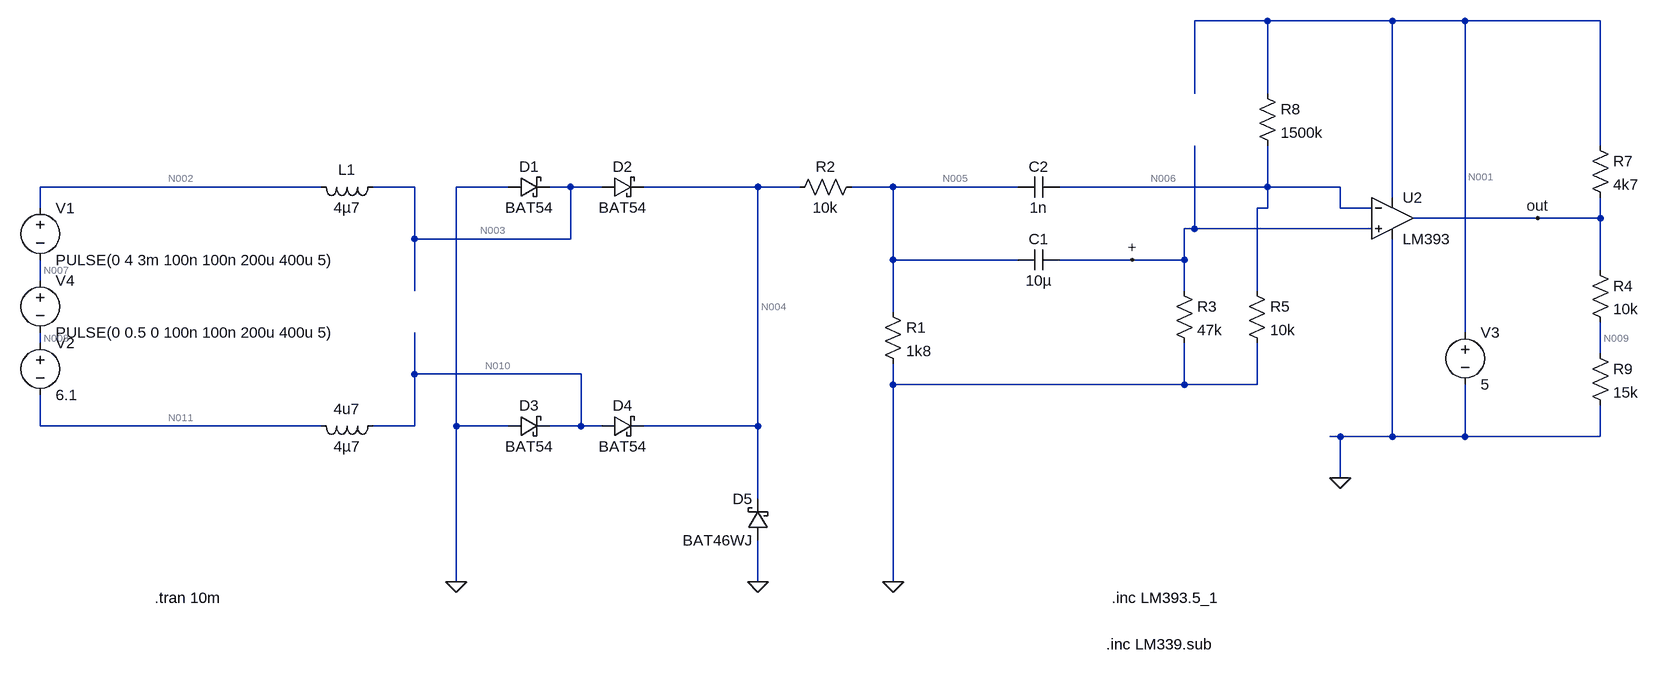
[diagram p0: schematic iRT_3.asc]
iRT_3.asc, the LTspice schematic file:
Version 4
SHEET 1 2576 804
WIRE 1584 -240 1472 -240
WIRE 1776 -240 1584 -240
WIRE 1888 -240 1776 -240
WIRE 2096 -240 1888 -240
WIRE 1472 -128 1472 -240
WIRE 1584 -128 1584 -240
WIRE 2096 -48 2096 -240
WIRE 128 16 -304 16
WIRE 272 16 208 16
WIRE 416 16 336 16
WIRE 512 16 480 16
WIRE 560 16 512 16
WIRE 800 16 624 16
WIRE 864 16 800 16
WIRE 1008 16 944 16
WIRE 1200 16 1008 16
WIRE 1584 16 1584 -48
WIRE 1584 16 1264 16
WIRE 1696 16 1584 16
WIRE 1776 32 1776 -240
WIRE -304 48 -304 16
WIRE 1584 48 1584 16
WIRE 1584 48 1568 48
WIRE 1696 48 1696 16
WIRE 1744 48 1696 48
WIRE 2000 64 1808 64
WIRE 2096 64 2096 32
WIRE 2096 64 2000 64
WIRE 1472 80 1472 -48
WIRE 1472 80 1456 80
WIRE 1744 80 1472 80
WIRE 272 96 272 16
WIRE 512 96 512 16
WIRE 512 96 272 96
WIRE 1008 128 1008 16
WIRE 1200 128 1008 128
WIRE 1376 128 1264 128
WIRE 1456 128 1456 80
WIRE 1456 128 1376 128
WIRE 2096 144 2096 64
WIRE -304 160 -304 128
WIRE 272 176 272 96
WIRE 1456 176 1456 128
WIRE 1568 176 1568 48
WIRE 1008 208 1008 128
WIRE 1888 240 1888 -240
WIRE -304 256 -304 240
WIRE 2096 272 2096 224
WIRE 272 304 272 240
WIRE 528 304 272 304
WIRE 1008 320 1008 288
WIRE 1456 320 1456 256
WIRE 1456 320 1008 320
WIRE 1568 320 1568 256
WIRE 1568 320 1456 320
WIRE -304 384 -304 336
WIRE 128 384 -304 384
WIRE 272 384 272 304
WIRE 272 384 208 384
WIRE 336 384 336 16
WIRE 416 384 336 384
WIRE 528 384 528 304
WIRE 528 384 480 384
WIRE 560 384 528 384
WIRE 800 384 800 16
WIRE 800 384 624 384
WIRE 1696 400 1680 400
WIRE 1776 400 1776 96
WIRE 1776 400 1696 400
WIRE 1888 400 1888 320
WIRE 1888 400 1776 400
WIRE 2096 400 2096 352
WIRE 2096 400 1888 400
WIRE 1696 464 1696 400
WIRE 800 496 800 384
WIRE 336 624 336 384
WIRE 800 624 800 560
WIRE 1008 624 1008 320
FLAG 800 624 0
FLAG 1008 624 0
FLAG 1696 464 0
FLAG 336 624 0
FLAG 1376 128 +
FLAG 2000 64 out
SYMBOL voltage -304 32 R0
WINDOW 123 0 0 Left 0
WINDOW 39 0 0 Left 0
SYMATTR InstName V1
SYMATTR Value PULSE(0 4 3m 100n 100n 200u 400u 5)
SYMBOL voltage -304 240 R0
WINDOW 123 0 0 Left 0
WINDOW 39 0 0 Left 0
SYMATTR InstName V2
SYMATTR Value 6.1
SYMBOL ind 224 0 R90
WINDOW 0 5 56 VBottom 2
WINDOW 3 32 56 VTop 2
SYMATTR InstName L1
SYMATTR Value 4µ7
SYMBOL ind 224 368 R90
WINDOW 0 5 56 VBottom 2
WINDOW 3 32 56 VTop 2
SYMATTR InstName 4u7
SYMATTR Value 4µ7
SYMBOL schottky 416 32 R270
WINDOW 0 32 32 VTop 2
WINDOW 3 0 32 VBottom 2
SYMATTR InstName D1
SYMATTR Value BAT54
SYMATTR Description Diode
SYMATTR Type diode
SYMBOL schottky 560 32 R270
WINDOW 0 32 32 VTop 2
WINDOW 3 0 32 VBottom 2
SYMATTR InstName D2
SYMATTR Value BAT54
SYMATTR Description Diode
SYMATTR Type diode
SYMBOL schottky 416 400 R270
WINDOW 0 32 32 VTop 2
WINDOW 3 0 32 VBottom 2
SYMATTR InstName D3
SYMATTR Value BAT54
SYMATTR Description Diode
SYMATTR Type diode
SYMBOL schottky 560 400 R270
WINDOW 0 32 32 VTop 2
WINDOW 3 0 32 VBottom 2
SYMATTR InstName D4
SYMATTR Value BAT54
SYMATTR Description Diode
SYMATTR Type diode
SYMBOL schottky 816 560 R180
WINDOW 0 24 64 Left 2
WINDOW 3 24 0 Left 2
SYMATTR InstName D5
SYMATTR Value BAT46WJ
SYMATTR Description Diode
SYMATTR Type diode
SYMBOL res 992 192 R0
SYMATTR InstName R1
SYMATTR Value 1k8
SYMBOL res 960 0 R90
WINDOW 0 0 56 VBottom 2
WINDOW 3 32 56 VTop 2
SYMATTR InstName R2
SYMATTR Value 10k
SYMBOL voltage 1888 224 R0
WINDOW 123 0 0 Left 0
WINDOW 39 0 0 Left 0
SYMATTR InstName V3
SYMATTR Value 5
SYMBOL voltage -304 144 R0
WINDOW 123 0 0 Left 0
WINDOW 39 0 0 Left 0
SYMATTR InstName V4
SYMATTR Value PULSE(0 0.5 0 100n 100n 200u 400u 5)
SYMBOL res 1440 160 R0
SYMATTR InstName R3
SYMATTR Value 47k
SYMBOL OpAmps\\opamp2 1776 0 R0
SYMATTR InstName U2
SYMATTR Value LM393
SYMBOL res 2080 -64 R0
SYMATTR InstName R7
SYMATTR Value 4k7
SYMBOL cap 1264 112 R90
WINDOW 0 0 32 VBottom 2
WINDOW 3 32 32 VTop 2
SYMATTR InstName C1
SYMATTR Value 10µ
SYMBOL cap 1264 0 R90
WINDOW 0 0 32 VBottom 2
WINDOW 3 32 32 VTop 2
SYMATTR InstName C2
SYMATTR Value 1n
SYMBOL res 1568 -144 R0
SYMATTR InstName R8
SYMATTR Value 1500k
SYMBOL res 2080 128 R0
SYMATTR InstName R4
SYMATTR Value 10k
SYMBOL res 2080 256 R0
SYMATTR InstName R9
SYMATTR Value 15k
SYMBOL res 1552 160 R0
SYMATTR InstName R5
SYMATTR Value 10k
TEXT -128 648 Left 2 !.tran 10m
TEXT 1344 648 Left 2 !.inc LM393.5_1
TEXT 1336 720 Left 2 !.inc LM339.sub

The netlist it stands for:
* iRT_3.asc
V1 N002 N007 PULSE(0 4 3m 100n 100n 200u 400u 5)
V2 N008 N011 6.1
L1 N003 N002 4µ7
L§4u7 N010 N011 4µ7
D1 0 N003 BAT54
D2 N003 N004 BAT54
D3 0 N010 BAT54
D4 N010 N004 BAT54
D5 0 N004 BAT46WJ
R1 N005 0 1k8
R2 N005 N004 10k
V3 N001 0 5
V4 N007 N008 PULSE(0 0.5 0 100n 100n 200u 400u 5)
R3 + 0 47k
XU2 + N006 N001 0 out LM393  ; pins In+ In- V+ V- OUT
R7 N001 out 4k7
C1 + N005 10µ
C2 N006 N005 1n
R8 N001 N006 1500k
R4 out N009 10k
R9 N009 0 15k
R5 N006 0 10k
.model D D
.lib standard.dio
.tran 10m
.inc LM393.5_1
.inc LM339.sub
.backanno
.end

* Results of the author's LTspice run, read from the files saved beside the schematic
* Operating Point, zero values left out:
*   V(n002) = 5.88 V
*   V(n007) = 5.88 V
*   V(n008) = 5.88 V
*   V(n011) = -220.3 mV
*   V(n003) = 5.88 V
*   V(n010) = -220.3 mV
*   V(n004) = 5.659 V
*   V(n005) = 863.3 mV
*   V(n001) = 5 V
*   V(+) = 1.811 mV
*   V(n006) = 33.23 mV
*   V(out) = 79.07 mV
*   V(n009) = 47.44 mV
*   I(D5) = -170.3 nA
*   I(D4) = -100 nA
*   I(D3) = 479.9 µA
*   I(D2) = 479.9 µA
*   I(D1) = -100 nA
*   I(4u7) = 480 µA
*   I(L1) = -480 µA
*   I(R5) = 3.323 µA
*   I(R9) = 3.163 µA
*   I(R4) = 3.163 µA
*   I(R8) = 3.311 µA
*   I(R7) = 1.047 mA
*   I(R3) = 38.54 nA
*   I(R2) = -479.6 µA
*   I(R1) = 479.6 µA
*   I(V4) = -480 µA
*   I(V3) = -1.204 mA
*   I(V2) = -480 µA
*   I(V1) = -480 µA
*   Ix(u2:1) = -38.54 nA
*   Ix(u2:2) = -11.44 nA
*   Ix(u2:3) = 153.8 µA
*   Ix(u2:4) = -1.198 mA
*   Ix(u2:5) = 1.044 mA
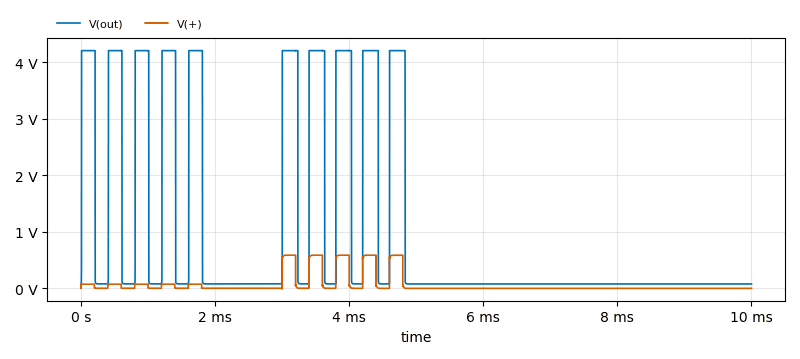
[diagram p1: Transient Analysis of iRT_3.asc, plotted from the saved traces]
* Transient Analysis, 1 run:
*   V(out): min 78.3 mV, max 4.213 V, average 978.8 mV, rms 1.965 V, last 78.31 mV
*   V(+): min -7.607 mV, max 588.7 mV, average 66.95 mV, rms 186.1 mV, last 461.9 µV